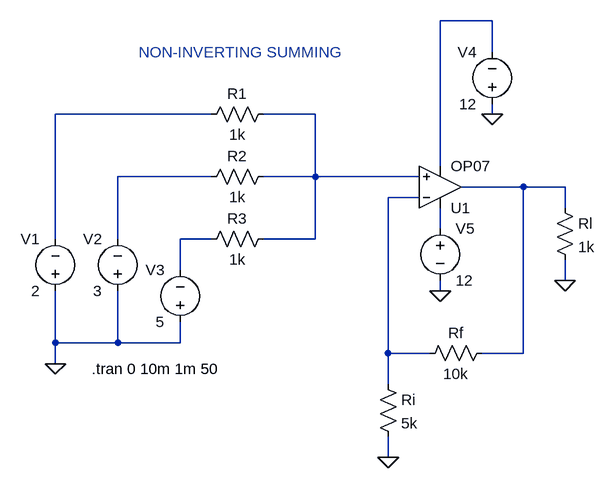
[diagram p0: schematic Non-Inverting Summing.asc]
Non-Inverting Summing.asc, the LTspice schematic file:
Version 4
SHEET 1 880 680
WIRE 400 -80 320 -80
WIRE 400 -32 400 -80
WIRE -32 64 -272 64
WIRE 128 64 48 64
WIRE 400 64 400 48
WIRE 320 144 320 -80
WIRE -32 160 -176 160
WIRE 128 160 128 64
WIRE 128 160 48 160
WIRE 288 160 128 160
WIRE 448 176 352 176
WIRE 512 176 448 176
WIRE 288 192 240 192
WIRE 512 208 512 176
WIRE 320 240 320 208
WIRE -272 256 -272 64
WIRE -176 256 -176 160
WIRE -32 256 -80 256
WIRE 128 256 128 160
WIRE 128 256 48 256
WIRE -80 304 -80 256
WIRE 512 320 512 288
WIRE 320 336 320 320
WIRE -272 416 -272 336
WIRE -176 416 -176 336
WIRE -176 416 -272 416
WIRE -80 416 -80 384
WIRE -80 416 -176 416
WIRE 240 432 240 192
WIRE 304 432 240 432
WIRE 448 432 448 176
WIRE 448 432 384 432
WIRE -272 448 -272 416
WIRE 240 480 240 432
WIRE 240 592 240 560
FLAG 512 320 0
FLAG -272 448 0
FLAG 320 336 0
FLAG 400 64 0
FLAG 240 592 0
SYMBOL OpAmps\\OP07 320 240 M180
SYMATTR InstName U1
SYMBOL res 64 48 R90
WINDOW 0 0 56 VBottom 2
WINDOW 3 32 56 VTop 2
SYMATTR InstName R1
SYMATTR Value 1k
SYMBOL res 64 144 R90
WINDOW 0 0 56 VBottom 2
WINDOW 3 32 56 VTop 2
SYMATTR InstName R2
SYMATTR Value 1k
SYMBOL res 64 240 R90
WINDOW 0 0 56 VBottom 2
WINDOW 3 32 56 VTop 2
SYMATTR InstName R3
SYMATTR Value 1k
SYMBOL res 496 192 R0
SYMATTR InstName Rl
SYMATTR Value 1k
SYMBOL res 400 416 R90
WINDOW 0 0 56 VBottom 2
WINDOW 3 32 56 VTop 2
SYMATTR InstName Rf
SYMATTR Value 10k
SYMBOL voltage -272 352 R180
WINDOW 0 24 96 Left 2
WINDOW 3 24 16 Left 2
SYMATTR InstName V1
SYMATTR Value 2
SYMBOL voltage -176 352 R180
WINDOW 0 24 96 Left 2
WINDOW 3 24 16 Left 2
SYMATTR InstName V2
SYMATTR Value 3
SYMBOL voltage -80 400 R180
WINDOW 0 24 96 Left 2
WINDOW 3 24 16 Left 2
SYMATTR InstName V3
SYMATTR Value 5
SYMBOL voltage 400 64 R180
WINDOW 0 24 96 Left 2
WINDOW 3 24 16 Left 2
SYMATTR InstName V4
SYMATTR Value 12
SYMBOL voltage 320 224 R0
SYMATTR InstName V5
SYMATTR Value 12
SYMBOL res 224 464 R0
SYMATTR InstName Ri
SYMATTR Value 5k
TEXT -216 456 Left 2 !.tran 0 10m 1m 50
TEXT -144 -32 Left 2 ;NON-INVERTING SUMMING

The netlist it stands for:
* Non-Inverting Summing.asc
XU1 N003 N006 N007 N001 N005 LT1001  ; OP07, pins In+ In- V+ V- OUT
R1 N003 N002 1k
R2 N003 N004 1k
R3 N003 N008 1k
Rl N005 0 1k
Rf N005 N006 10k
V1 0 N002 2
V2 0 N004 3
V3 0 N008 5
V4 0 N001 12
V5 N007 0 12
Ri N006 0 5k
.tran 0 10m 1m 50
* NON-INVERTING SUMMING
.lib LTC.lib
.backanno
.end